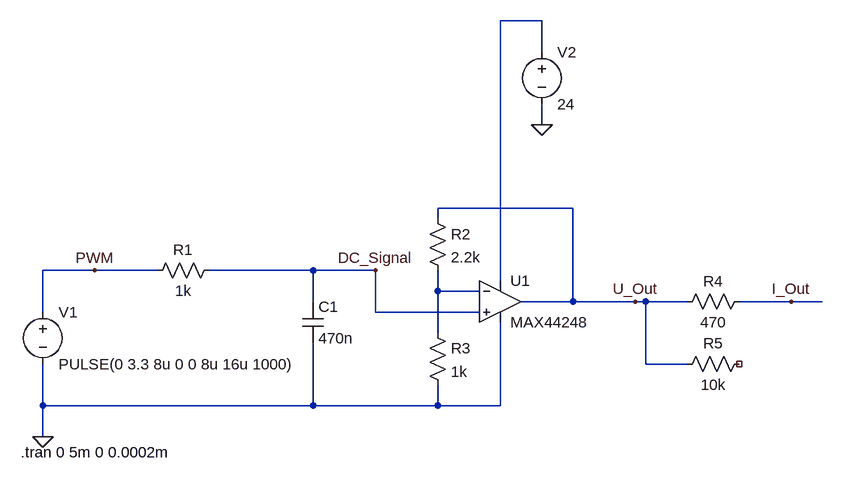
[diagram p0: schematic PWM-to-AnalogOutput.asc]
PWM-to-AnalogOutput.asc, the LTspice schematic file:
Version 4
SHEET 1 1156 680
WIRE 720 -240 656 -240
WIRE 720 -192 720 -240
WIRE 720 -80 720 -112
WIRE 768 48 560 48
WIRE 560 64 560 48
WIRE 32 144 -48 144
WIRE 128 144 32 144
WIRE 368 144 208 144
WIRE 464 144 368 144
WIRE 656 160 656 -240
WIRE 560 176 560 144
WIRE 624 176 560 176
WIRE 368 192 368 144
WIRE 768 192 768 48
WIRE 768 192 688 192
WIRE 864 192 768 192
WIRE 880 192 864 192
WIRE 944 192 880 192
WIRE 1104 192 1024 192
WIRE 1152 192 1104 192
WIRE -48 208 -48 144
WIRE 464 208 464 144
WIRE 624 208 464 208
WIRE 560 240 560 176
WIRE 880 288 880 192
WIRE 944 288 880 288
WIRE -48 352 -48 288
WIRE 368 352 368 256
WIRE 368 352 -48 352
WIRE 560 352 560 320
WIRE 560 352 368 352
WIRE 656 352 656 224
WIRE 656 352 560 352
WIRE -48 400 -48 352
FLAG -48 400 0
FLAG 720 -80 0
FLAG 864 192 U_Out
FLAG 1104 192 I_Out
FLAG 32 144 PWM
FLAG 464 144 DC_Signal
SYMBOL voltage -48 192 R0
WINDOW 123 0 0 Left 0
WINDOW 39 0 0 Left 0
SYMATTR InstName V1
SYMATTR Value PULSE(0 3.3 8u 0 0 8u 16u 1000)
SYMBOL voltage 720 -208 R0
WINDOW 123 0 0 Left 0
WINDOW 39 0 0 Left 0
SYMATTR InstName V2
SYMATTR Value 24
SYMBOL res 224 128 R90
WINDOW 0 0 56 VBottom 2
WINDOW 3 32 56 VTop 2
SYMATTR InstName R1
SYMATTR Value 1k
SYMBOL cap 352 192 R0
SYMATTR InstName C1
SYMATTR Value 470n
SYMBOL OpAmps\\MAX44248 656 128 R0
SYMATTR InstName U1
SYMBOL res 544 48 R0
SYMATTR InstName R2
SYMATTR Value 2.2k
SYMBOL res 544 224 R0
SYMATTR InstName R3
SYMATTR Value 1k
SYMBOL res 1040 176 R90
WINDOW 0 0 56 VBottom 2
WINDOW 3 32 56 VTop 2
SYMATTR InstName R4
SYMATTR Value 470
SYMBOL res 928 304 R270
WINDOW 0 32 56 VTop 2
WINDOW 3 0 56 VBottom 2
SYMATTR InstName R5
SYMATTR Value 10k
TEXT -82 424 Left 2 !.tran 0 5m 0 0.0002m

The netlist it stands for:
* PWM-to-AnalogOutput.asc
V1 PWM 0 PULSE(0 3.3 8u 0 0 8u 16u 1000)
V2 N001 0 24
R1 DC_Signal PWM 1k
C1 DC_Signal 0 470n
XU1 DC_Signal N002 N001 0 U_Out MAX44248  ; pins In+ In- V+ V- OUT
R2 U_Out N002 2.2k
R3 N002 0 1k
R4 I_Out U_Out 470
R5 U_Out NC_01 10k
.tran 0 5m 0 0.0002m
.backanno
.end